# Altium project JWB-001.PrjPcb
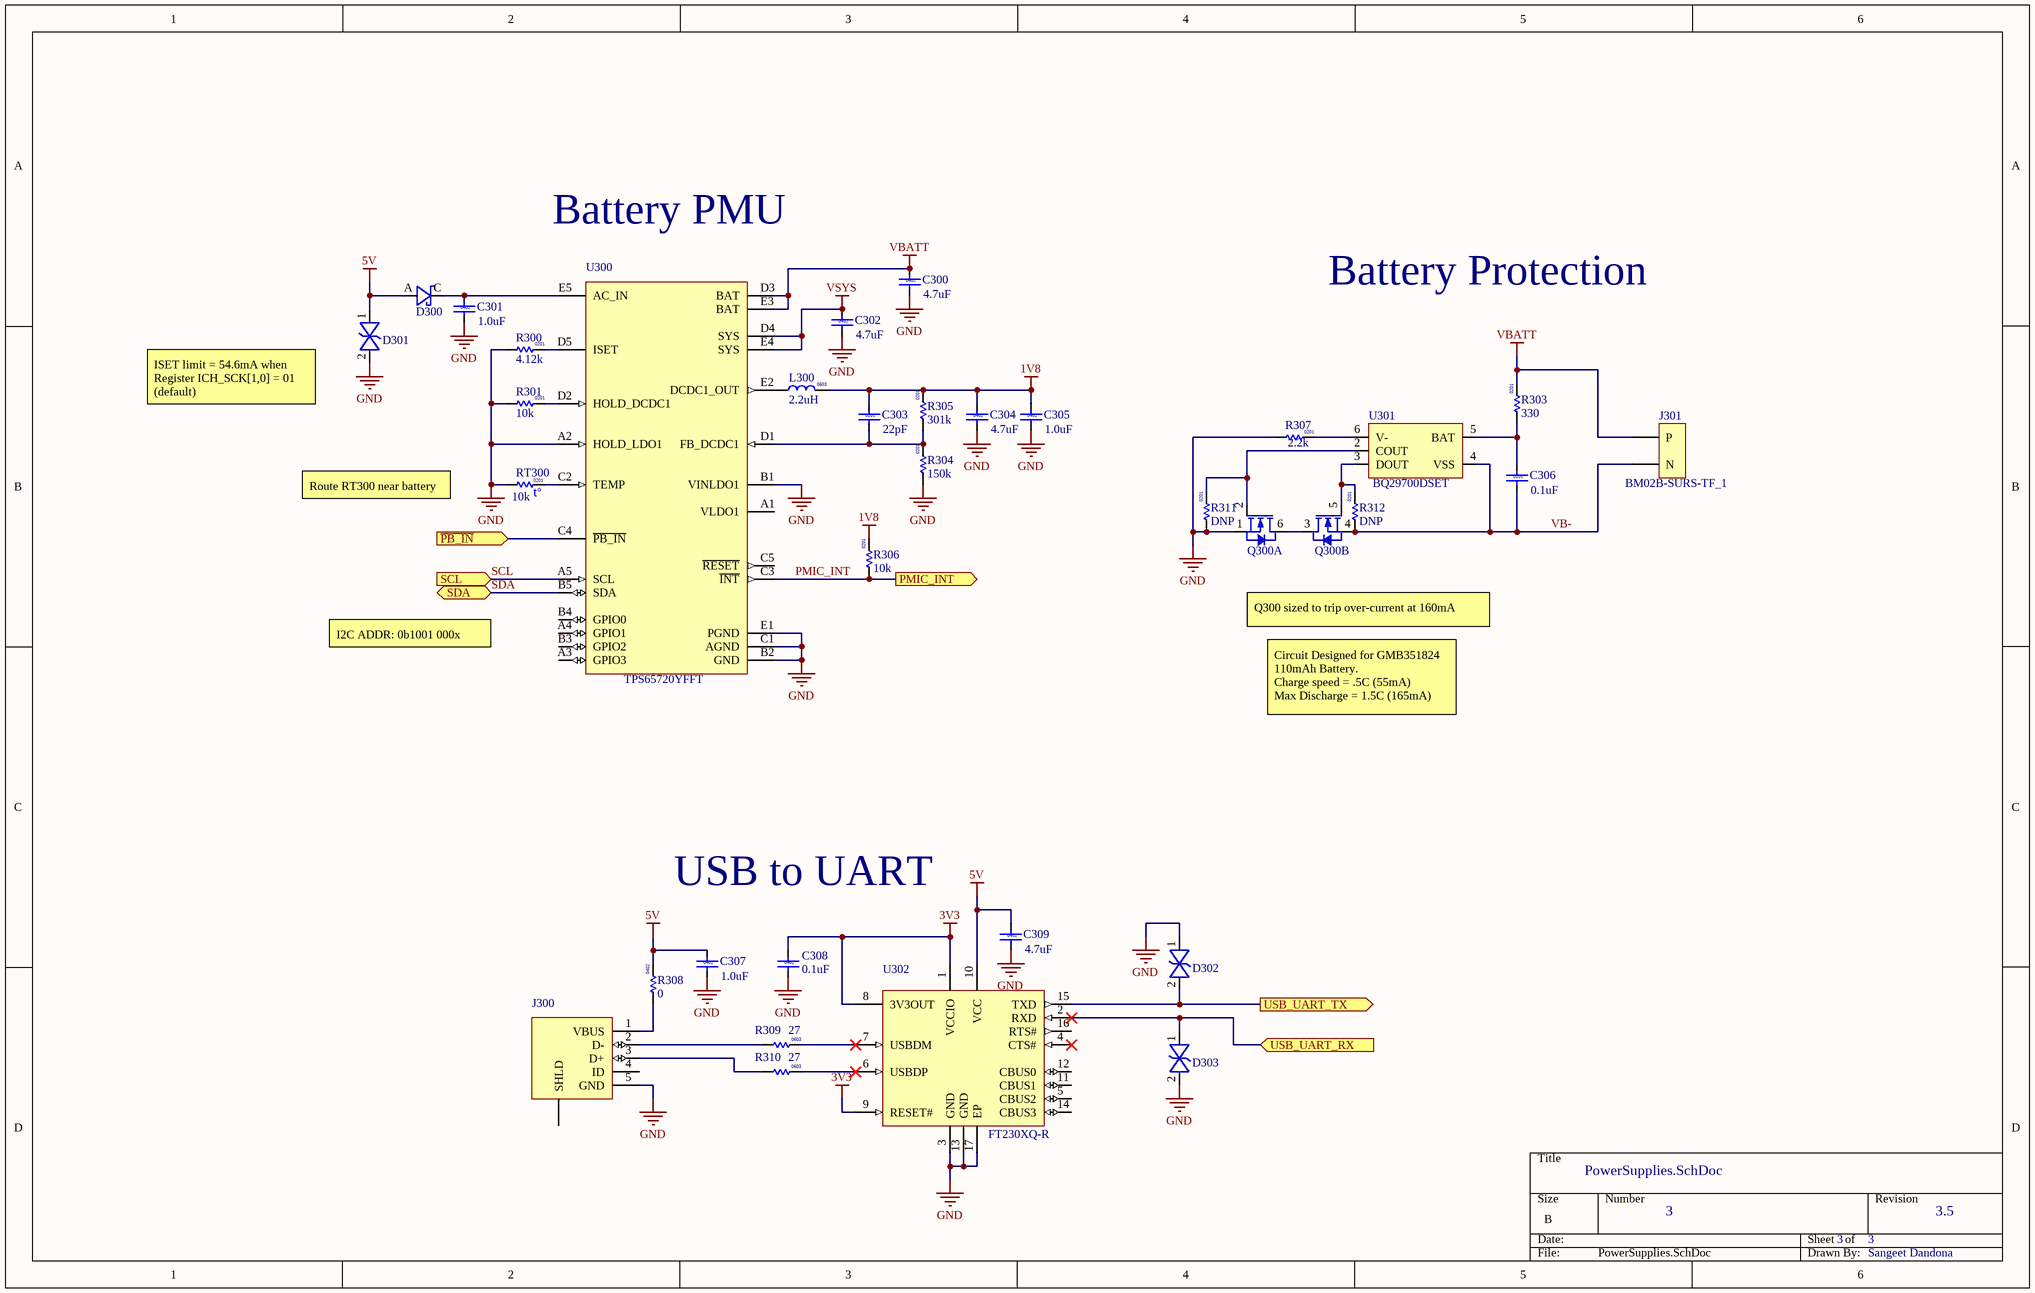
[diagram p0: PowerSupplies.SchDoc]
PCBA_PartNumber: A; PCB_Title: Jewelbots-001; PCB_Rev: 3.7; PCB_partnumber: JWB-001; Engineer: S. Dandona; Company: Jewelbots, Inc.; Address3: New York, NY 10002; Address2: 5th floor; Address1: 50 Eldridge St.
1 sheet, 34 parts. Net scope: flat (ports and power ports of the same name join across sheets).
Board file: JWB-001.PcbDoc

## Sheet PowerSupplies.SchDoc
size B; DocumentNumber: 3; Revision: 3.0; SheetNumber: 3; SheetTotal: 3

### Parts
C300  value 4.7uF  Size: 0402  [Cap 0402 HD]
C301  value 1.0uF  Size: 0402  [Cap 0402 HD]
C302  value 4.7uF  Size: 0402  [Cap 0402 HD]
C303  value 22pF  Size: 0201  [Cap 0201 HD]
C304  value 4.7uF  Size: 0402  [Cap 0402 HD]
C305  value 1.0uF  Size: 0402  [Cap 0402 HD]
C306  value 0.1uF  Size: 0201  [Cap 0201 HD]
C307  value 1.0uF  Size: 0402  [Cap 0402 HD]
C308  value 0.1uF  Size: 0402  [Cap 0402 HD]
C309  value 4.7uF  Size: 0402  [Cap 0402 HD]
D300  (no value)  [Diode 0603 HD]
D301  (no value)  [CAP 0402 HD]
D302  (no value)  [CAP 0402 HD]
D303  (no value)  [CAP 0402 HD]
J300  (no value)  [USB_Micro_RA_W-TABS]
J301  BM02B-SURS-TF_1  [BM02B-SURS-TF]
L300  value 2.2uH  Size: 0603  [IND 0603]
Q300  (no value)  [SC70-6]  (parts A,B of 2)
R300  value 4.12k  Size: 0201  [RES 0201 HD]
R301  value 10k  Size: 0201  [RES 0201 HD]
R303  value 330  Size: 0201  [RES 0201 HD]
R304  value 150k  Size: 0201  [RES 0201 HD]
R305  value 301k  Size: 0201  [RES 0201 HD]
R306  value 10k  Size: 0201  [RES 0201 HD]
R307  value 2.2k  Size: 0201  [RES 0201 HD]
R308  value 0  Size: 0402  [RES 0402]
R309  value 27  Size: 0603  [RES 0603 HD]
R310  value 27  Size: 0603  [RES 0603 HD]
R311  value DNP  Size: 0201  [RES 0201 HD]
R312  value DNP  Size: 0201  [RES 0201 HD]
RT300  value 10k  Size: 0201  [RES 0201 HD]  (hidden comment: Res Thermal)
U300  MFPN: TPS65720YFFT  [BGA0.4P5x5-25Pin]
U301  MFPN: BQ29700DSET  [SON0.5P-6Pin]
U302  MFPN: FT230XQ-R  [QFN0.65P4x4-16Pin_W-Pad]

### Ports
PMIC_INT (out), SCL (in), SDA (bidir), USB_UART_RX (in), USB_UART_TX (out), ~{PB_IN} (in)

### Nets
1V8: C303.1 C304.1 C305.1 L300.2 R305.2 R306.2
3V3: C308.1 U302.1(VCCIO) U302.8(3V3OUT) U302.9(RESET#)
5V: C307.1 C309.1 D300.A D301.1 R308.2 U302.10(VCC)
GND: C300.2 C301.2 C302.2 C304.2 C305.2 C307.2 C308.2 C309.2 D301.2 D302.1 D303.2 J300.5(GND) Q300.1(S1) R300.1 R301.1 R304.1 R307.1 R311.1 RT300.2 U300.A2(HOLD_LDO1) U300.B1(VINLDO1) U300.B2(GND) U300.C1(AGND) U300.E1(PGND) U302.3(GND) U302.13(GND) U302.17(EP)
VBATT: C300.1 J301.1(P) R303.2 U300.D3(BAT) U300.E3(BAT)
VSYS: C302.1 U300.D4(SYS) U300.E4(SYS)
PMIC_INT: R306.1 U300.C3(~{INT}) ; port PMIC_INT
SCL: U300.A5(SCL) ; port SCL
SDA: U300.B5(SDA) ; port SDA
VB-: C306.2 J301.2(N) Q300.4(S2) R312.1 U301.4(VSS)
NetC301_1: C301.1 D300.C U300.E5(AC_IN)
NetC303_2: C303.2 R304.2 R305.1 U300.D1(FB_DCDC1)
NetC306_1: C306.1 R303.1 U301.5(BAT)
NetD302_2: D302.2 U302.15(TXD) ; port USB_UART_TX
NetD303_1: D303.1 U302.2(RXD) ; port USB_UART_RX
NetJ300_1: J300.1(VBUS) R308.1
NetJ300_2: J300.2(D-) R309.1
NetJ300_3: J300.3(D+) R310.1
NetL300_1: L300.1 U300.E2(DCDC1_OUT)
NetQ300_2: Q300.2(G1) R311.2 U301.2(COUT)
NetQ300_3: Q300.3(D2) Q300.6(D1)
NetQ300_5: Q300.5(G2) R312.2 U301.3(DOUT)
NetR300_2: R300.2 U300.D5(ISET)
NetR301_2: R301.2 U300.D2(HOLD_DCDC1)
NetR307_2: R307.2 U301.6(V-)
NetR309_2: R309.2 U302.7(USBDM)
NetR310_2: R310.2 U302.6(USBDP)
NetRT300_1: RT300.1 U300.C2(TEMP)
NetU300_C4: U300.C4(~{PB_IN}) ; port ~{PB_IN}

Not connected (* = marked no-connect by the designer): J300 4(ID) 6(SHLD); U300 A1(VLDO1) A3(GPIO3) A4(GPIO1) B3(GPIO2) B4(GPIO0) C5(~{RESET}); U301 1(NC); U302 4(CTS#)* 5(CBUS2) 11(CBUS1) 12(CBUS0) 14(CBUS3) 16(RTS#)

### Notes on the sheet
- Battery PMU
- Battery Protection
- ISET limit = 54.6mA when
  Register ICH_SCK[1,0] = 01
  (default)
- Route RT300 near battery
- I2C ADDR: 0b1001 000x
- Q300 sized to trip over-current at 160mA
- Circuit Designed for GMB351824
  110mAh Battery.
  Charge speed = .5C (55mA)
  Max Discharge = 1.5C (165mA)
- USB to UART
- 3.5
- Sangeet Dandona
- (in symbol Therm 0201 10k NTC) t°

### Library data of the parts
C300 C302 C304 C309 = Cap 0402 4.7uF 10V: CAP CER 4.7UF 10V 20% X5R 0402; MF: Samsung Electro-Mechanics America, Inc.; MFPN: CL05A475MP5NRNC; Cost: 0.09690
C301 C305 C307 = Cap 0402 1.0uF 10V: CAP CER 1UF 10V 10% X5R 0402; MF: Murata Electronics North America; MFPN: GRM155R61A105KE15D; Cost: 0.00825
C303 = Cap 0201 22pF 50V: CAP CER 22PF 50V 5% NP0 0201; MF: Murata Electronics North America; MFPN: GRM0335C1H220JA01D; Cost: 0.00475
C306 = Cap 0201 0.1uF 6.3V: CAP CER 0.1UF 6.3V 10% X5R 0201; MF: Murata Electronics North America; MFPN: GRM033R60J104KE19D; Cost: 0.00650
C308 = Cap 0402 0.1uF 10V: CAP CER 0.1UF 10V 10% X5R 0402; MFPN: GRM155R61A104KA01J; MF: Murata Electronics North America; Cost: 0.00250
D300 = CDBU05x0: DIODE SCHOTTKY 20V 500MA 0603; MF: Comchip Technology; MFPN: CDBU0520; Size: 1.8mm x 1.0mm; Type: Schottky; Cost: 0.09888
D301 = SESD0402P1BN-0450-090: TVS DIODE 6VWM 12VC 0402; MF: TE Connectivity Raychem Circuit Protection; MFPN: SESD0402P1BN-0450-090CT-ND; Size: 1.1mm x 0.5mm; Cost: 0.11000; Type: TVS
D302 D303 = SESD0402P1BN-0450-090: TVS DIODE 6VWM 12VC 0402; MF: TE Connectivity Raychem Circuit Protection; Size: 1.1mm x 0.5mm; Type: TVS; Cost: 0.11000; MFPN: SESD0402P1BN-0450-090
J300 = USB_Micro_B_W-Tabs: CONN USB MICRO B RECPT SMT R/A; MF: FCI; MFPN: 10118194-0001LF; Size: 8mm x 5mm; Cost: 0.18000
J301 = BM02B-SURS-TF_1: CONN HDR SUR TOP 2POS 0.8MM TIN; MF: JST Sales America Inc.; Pitch: 0.031" (0.80mm); MFPN: BM02B-SURS-TF(LF)(SN); Cost: 0.19072
L300 = Ind 0603 2.2uH 160mA: FIXED IND 2.2UH 600MA 170 MOHM; MFPN: GLFR1608T2R2M-LR; MF: TDK Corporation; Cost: 0.12190
Q300 = Si1902CDL: MOSFET 2N-CH 20V 1.1A SC-70-6; Type: N-MOSFET; MF: Vishay Siliconix; MFPN: SI1902CDL-T1-GE3; Size: 2.4mm x 2.2mm; Cost: 0.13690
R300 = Res 0201 Generic: RES SMD 4.12K OHM 1% 1/20W 0201; MF: Yageo; MFPN: RC0201FR-074K12L; Cost: 0.00535
R301 = Res 0201 10k 5%: RES SMD 10K OHM 5% 1/20W 0201; MF: Rohm Semiconductor; MFPN: MCR006YRTJ103; Cost: 0.00594
R303 = Res 0201 330R 5%: RES SMD 330 OHM 5% 1/20W 0201; MFPN: MCR006YRTJ331; MF: Rohm Semiconductor; Cost: 0.00640
R304 = Res 0201 150k 1%: RES SMD 150K OHM 1% 1/20W 0201; MF: Rohm Semiconductor; MFPN: MCR006YRTF1503; Cost: 0.00790
R305 = Res 0201 301k 1%: RES SMD 301K OHM 1% 1/20W 0201; MF: Samsung Electro-Mechanics America, Inc.; MFPN: RC0603F3013CS; Cost: 0.01035
R306 = Res 0201 10k 5%: RES SMD 10K OHM 5% 1/20W 0201; MFPN: MCR006YRTJ103; MF: Rohm Semiconductor; Cost: 0.00594
R307 = Res 0201 2.2k 5%: RES SMD 2.2K OHM 5% 1/20W 0201; MF: Panasonic Electronic Components; MFPN: ERJ-1GEJ222C; Cost: 0.00564
R308 = Res 0402 0R Jumper: RES SMD 0.0OHM JUMPER 1/16W 0402; MF: Samsung Electro-Mechanics America, Inc.; MFPN: RC1005J000CS; Cost: 0.00127
R309 R310 = Res 0603 27R 5%: RES SMD 27 OHM 5% 1/10W 0603; MF: Rohm Semiconductor; MFPN: MCR03ERTJ270; Cost: 0.00220
R311 R312 = Res 0201 Generic: Resistor, 0201, DNP; Cost: 0; MF: N/A; MFPN: DNP
RT300 = Therm 0201 10k NTC: THERMISTOR 10K OHM NTC 0201 SMD; MF: Murata Electronics North America; MFPN: NCP03XH103J05RL; Cost: 0.08041
U300 = TPS65720: PMU for IC PMU 2CH CONV/LDO 25DSBGA; MFG Footprint: S-XBGA-N25; MF: Texas Instruments; Size: 2.12mm x 2.12mm; Cost: 1.15250
U301 = BQ29700: IC LITHIUM BATT PROTECT 6-SON; MFG Footprint: DSE (S-PWSON-N6); MF: Texas Instruments; Size: 1.55mm x 1.55mm; Cost: 0.29870
U302 = FT230XQ: IC USB SERIAL BASIC UART 16QFN; MF: FTDI, Future Technology Devices International Ltd; Height: .8mm; Size: 4.1mm x 4.1mm; Cost: 1.43750